# EAGLE schematic Liploft_Schematics (EAGLE 9.5.2)
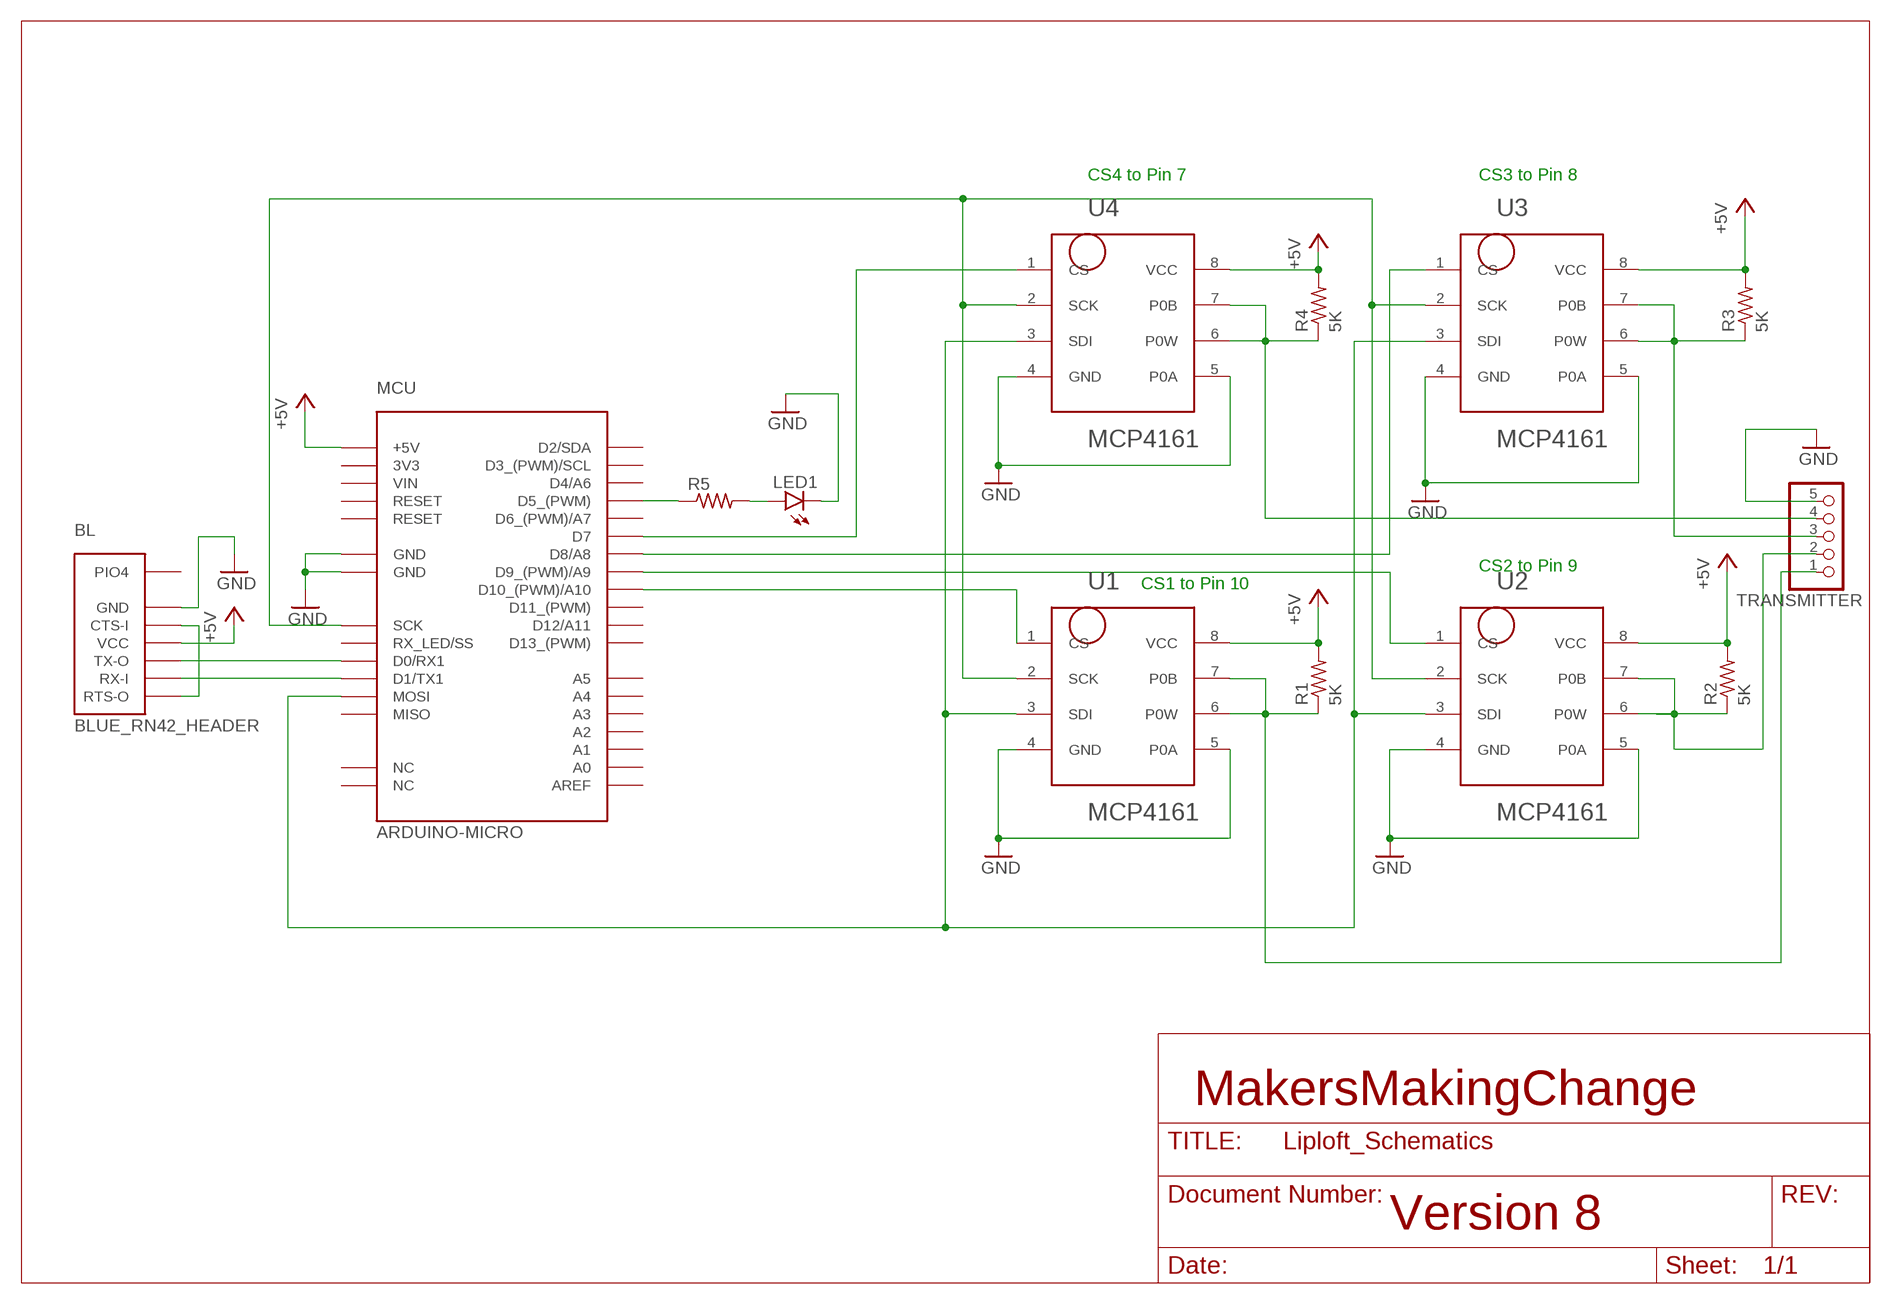
[diagram p0: schematic, sheet 1]

## Parts
BL  BLUE_RN42_HEADER  [BLUE_RN42_HEADER]
LED1  LED5MM  [LED5MM]
MCU  ARDUINO-MICRO  [ARDUINO_MICRO_HEADER]
R1  5K  R-US_0204/7  [0204/7]
R2  5K  R-US_0204/7  [0204/7]
R3  5K  R-US_0204/7  [0204/7]
R4  5K  R-US_0204/7  [0204/7]
R5  R-US_0204/7  [0204/7]
TRANSMITTER  PINHD-1X5  [1X05]
U1  MCP4161  [DIL08]
U2  MCP4161  [DIL08]
U3  MCP4161  [DIL08]
U4  MCP4161  [DIL08]

## Nets
+5V: BL.VCC MCU.5V(+5V) R1.2 R2.2 R3.2 R4.2 U1.8(VCC) U2.8(VCC) U3.8(VCC) U4.8(VCC)
GND: BL.GND LED1.K(C) TRANSMITTER.5 U1.4(GND) U1.5(P0A) U2.4(GND) U2.5(P0A) U3.4(GND) U3.5(P0A) U4.4(GND) U4.5(P0A)
GND@1: MCU.GND MCU.GND@1(GND) ; supply symbol labelled GND
N$1: MCU.D5(D5_(PWM)) R5.1
N$2: LED1.A R5.2
N$3: BL.TX-O MCU.RX1(D0/RX1)
N$4: BL.RX-I MCU.TX1(D1/TX1)
N$5: MCU.D10(D10_(PWM)/A10) U1.1(CS)
N$6: MCU.D9(D9_(PWM)/A9) U2.1(CS)
N$7: MCU.D8(D8/A8) U3.1(CS)
N$8: MCU.D7 U4.1(CS)
N$9: MCU.SCK U1.2(SCK) U2.2(SCK) U3.2(SCK) U4.2(SCK)
N$10: MCU.MOSI U1.3(SDI) U2.3(SDI) U3.3(SDI) U4.3(SDI)
N$11: R1.1 TRANSMITTER.1 U1.6(P0W) U1.7(P0B)
N$12: R4.1 TRANSMITTER.4 U4.6(P0W) U4.7(P0B)
N$13: R3.1 TRANSMITTER.3 U3.6(P0W) U3.7(P0B)
N$14: BL.CTS-I BL.RTS-O
N$15: R2.1 TRANSMITTER.2 U2.6(P0W) U2.7(P0B)
Unconnected: BL.PIO4 MCU.A0 MCU.A1 MCU.A2 MCU.A3 MCU.A4 MCU.A5 MCU.D2(D2/SDA) MCU.D3(D3_(PWM)/SCL) MCU.D4(D4/A6) MCU.D6(D6_(PWM)/A7) MCU.D11(D11_(PWM)) MCU.D12(D12/A11) MCU.D13(D13_(PWM)) MCU.MISO MCU.NC MCU.NC@1(NC) MCU.REF(AREF) MCU.RST(RESET) MCU.RST@1(RESET) MCU.SS(RX_LED/SS) MCU.VIN

## Notes on the sheet
- CS4 to Pin 7 | CS3 to Pin 8
- CS2 to Pin 9
- CS1 to Pin 10
- MakersMakingChange
- Version 8

## Power pins joined to a net without a drawn wire
3V3: MCU.3V3

## Library data of the parts
BL = MMC Eagle:BLUE_RN42_HEADER
LED1 = led:LED: LED OSRAM: - CHIPLED LG R971, LG N971, LY N971, LG Q971, LY Q971, LO R971, LY R971 LH N974, LH R974 LS Q976, LO Q976, LY Q976 LO Q996 - Hyper CHIPLED LW Q18S LB Q993, LB Q99A, LB R99A - SideLED LS A670, LO A670, LY A670, LG A670, LP A670 LB A673, LV A673, LT A673, LW A673 LH A674 LY A675 LS A676, LA A676, LO A676, LY A676, LW A676 LS A679, LY A679, LG A679 - Hyper Micro SIDELED® LS Y876, LA Y876, LO Y876, LY Y876 LT Y87S - SmartLED LW L88C, LW L88S LB L89C, LB L89S, LG L890 LS L89K, LO L89K, LY L89K LS L896, LA L896, LO L896, LY L896 - TOPLED LS T670, LO T670, LY T670, LG T670, LP T670 LSG T670, LSP T670, LSY T670, LOP T670, LYG T670 LG T671, LOG T671, LSG T671 LB T673, LV T673, LT T673, LW T673 LH T674 LS T676, LA T676, LO T676, LY T676, LB T676, LH T676, LSB T676, LW T676 LB T67C, LV T67C, LT T67C, LS T67K, LO T67K, LY T67K, LW E67C LS E67B, LA E67B, LO E67B, LY E67B, LB E67C, LV E67C, LT E67C LW T67C LS T679, LY T679, LG T679 LS T770, LO T770, LY T770, LG T770, LP T770 LB T773, LV T773, LT T773, LW T773 LH T774 LS E675, LA E675, LY E675, LS T675 LS T776, LA T776, LO T776, LY T776, LB T776 LHGB T686 LT T68C, LB T68C - Hyper Mini TOPLED® LB M676 - Mini TOPLED Santana® LG M470 LS M47K, LO M47K, LY M47K Source: http://www.osram.convergy.de LUXEON: - LUMILED® LXK2-PW12-R00, LXK2-PW12-S00, LXK2-PW14-U00, LXK2-PW14-V00 LXK2-PM12-R00, LXK2-PM12-S00, LXK2-PM14-U00 LXK2-PE12-Q00, LXK2-PE12-R00, LXK2-PE12-S00, LXK2-PE14-T00, LXK2-PE14-U00 LXK2-PB12-K00, LXK2-PB12-L00, LXK2-PB12-M00, LXK2-PB14-N00, LXK2-PB14-P00, LXK2-PB14-Q00 LXK2-PR12-L00, LXK2-PR12-M00, LXK2-PR14-Q00, LXK2-PR14-R00 LXK2-PD12-Q00, LXK2-PD12-R00, LXK2-PD12-S00 LXK2-PH12-R00, LXK2-PH12-S00 LXK2-PL12-P00, LXK2-PL12-Q00, LXK2-PL12-R00 Source: www.luxeon.com KINGBRIGHT: KA-3528ASYC Source: www.kingbright.com
MCU = MMC Eagle:ARDUINO-MICRO
R1-R5 = rcl:R-US_: RESISTOR, American symbol; SPICEPREFIX: R
TRANSMITTER = pinhead:PINHD-1X5: PIN HEADER
U1-U4 = MMC Eagle:MCP4161